# EAGLE schematic EEG_v2_0 (EAGLE 9.5.2)

## Sheet 1 of 2
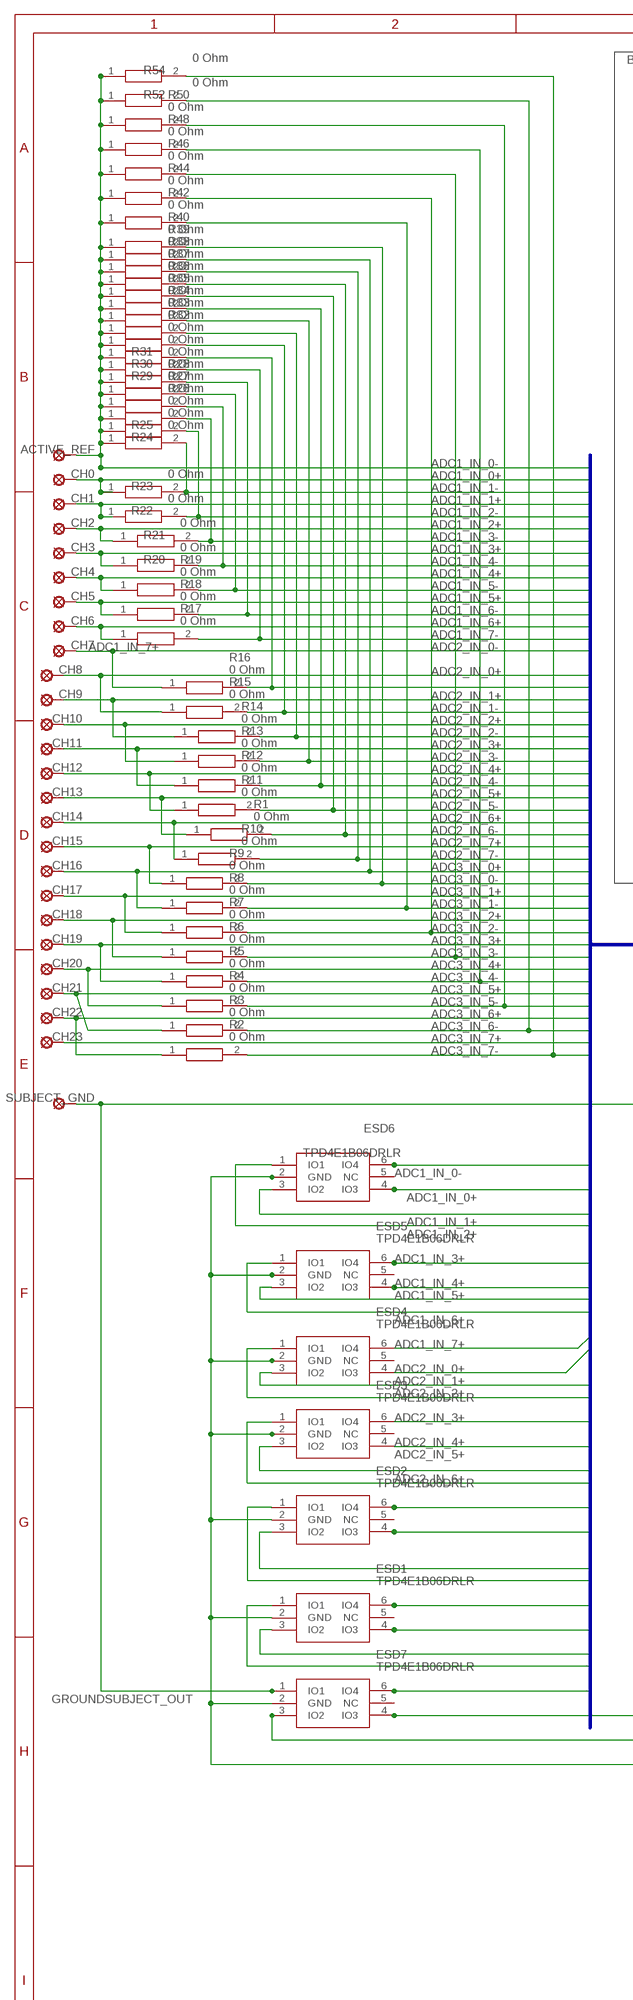
[diagram p0: schematic, sheet 1, part 1 of 2]
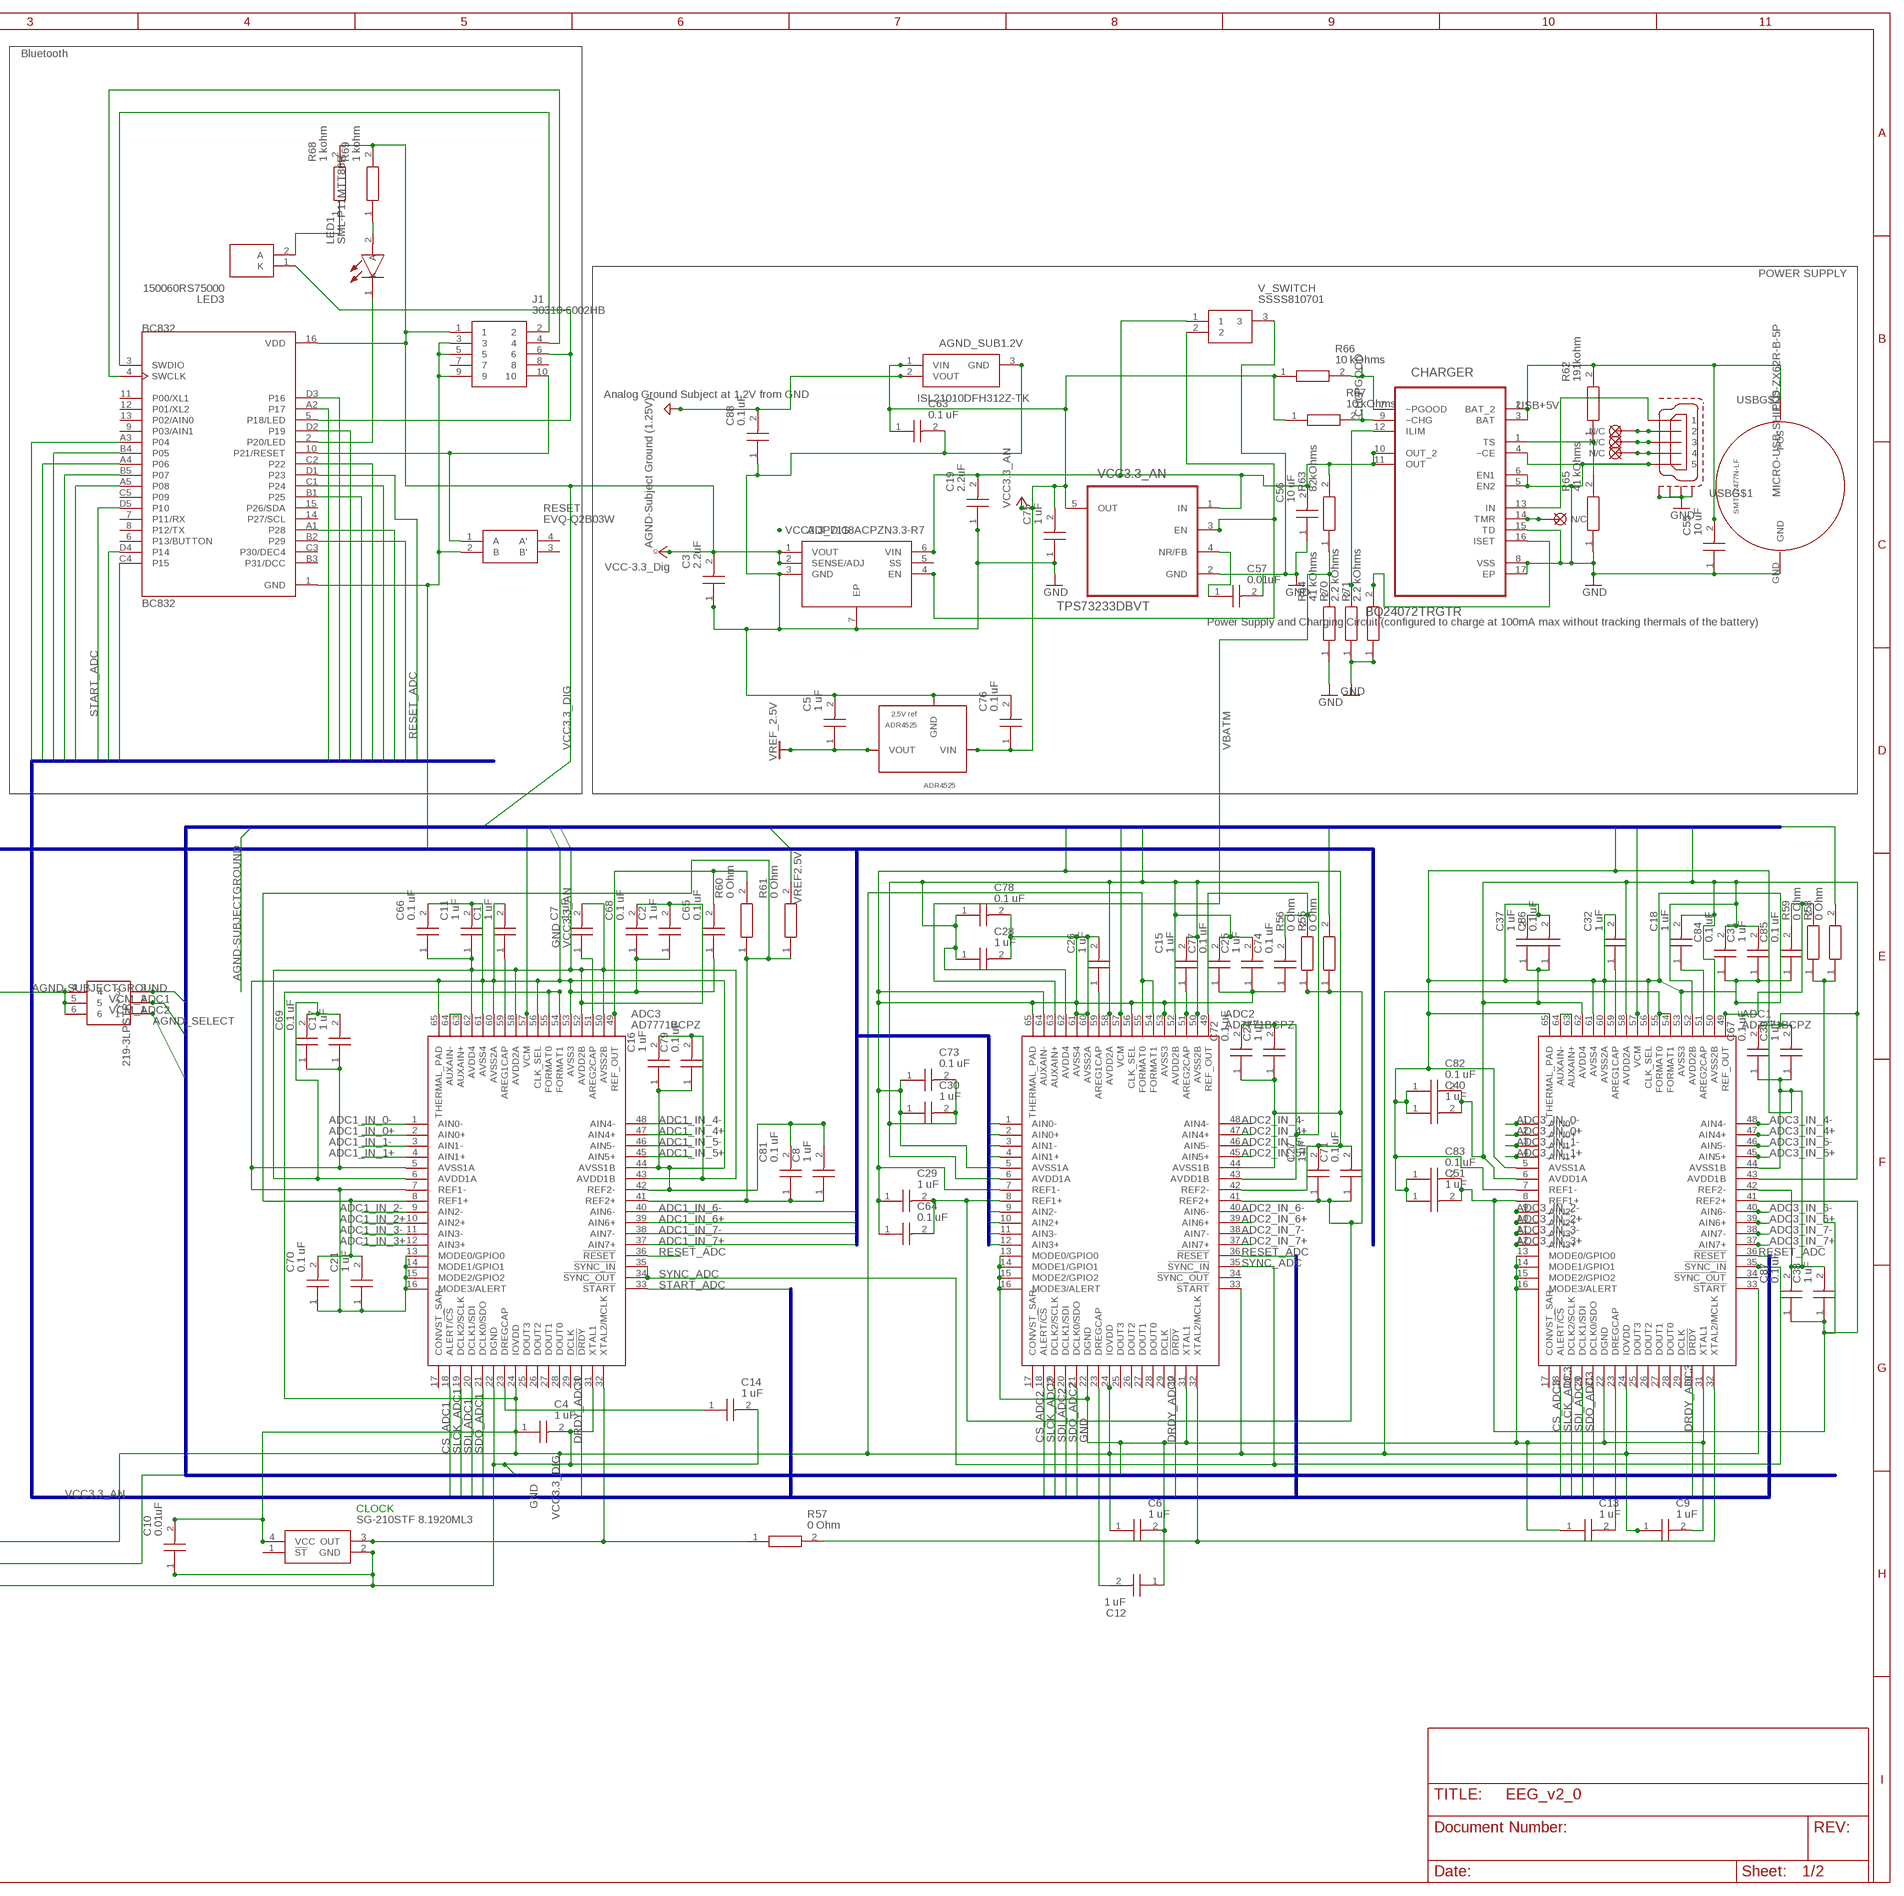
[diagram p1: schematic, sheet 1, part 2 of 2]

### Parts
ACTIVE_REF  SE11  [SE11]
ADC1  AD7771BCPZ  [QFN50P900X900X80-65N]
ADC2  AD7771BCPZ  [QFN50P900X900X80-65N]
ADC3  AD7771BCPZ  [QFN50P900X900X80-65N]
ADC_REF  SMTU2477N-LF  [SMTU2477N-LF]
ADR4525  ADR4525  [SOIC-8]
AGND_SELECT  219-3LPSTR  [2193LPSTR]
AGND_SUB1.2V  ISL21010DFH312Z-TK  [SOT95P237X112-3N]
BC832  BC832  [XCVR_BC832]
C1  1 uF  JMK105BJ105MP-F  [CAPC1005X33N]
C2  1 uF  JMK105BJ105MP-F  [CAPC1005X33N]
C3  2.2uF  GRM033R60J225ME47D  [CAPC0603X33N]
C4  1 uF  JMK105BJ105MP-F  [CAPC1005X33N]
C5  1 uF  JMK105BJ105MP-F  [CAPC1005X33N]
C6  1 uF  JMK105BJ105MP-F  [CAPC1005X33N]
C7  1 uF  JMK105BJ105MP-F  [CAPC1005X33N]
C8  1 uF  JMK105BJ105MP-F  [CAPC1005X33N]
C9  1 uF  JMK105BJ105MP-F  [CAPC1005X33N]
C10  0.01uF  GRM022R60J103ME19L  [CAPC0402X22N]
C11  1 uF  JMK105BJ105MP-F  [CAPC1005X33N]
C12  1 uF  JMK105BJ105MP-F  [CAPC1005X33N]
C13  1 uF  JMK105BJ105MP-F  [CAPC1005X33N]
C14  1 uF  JMK105BJ105MP-F  [CAPC1005X33N]
C15  1 uF  JMK105BJ105MP-F  [CAPC1005X33N]
C16  1 uF  JMK105BJ105MP-F  [CAPC1005X33N]
C17  1 uF  JMK105BJ105MP-F  [CAPC1005X33N]
C18  1 uF  JMK105BJ105MP-F  [CAPC1005X33N]
C19  2.2uF  GRM033R60J225ME47D  [CAPC0603X33N]
C21  1 uF  JMK105BJ105MP-F  [CAPC1005X33N]
C24  1 uF  JMK105BJ105MP-F  [CAPC1005X33N]
C25  1 uF  JMK105BJ105MP-F  [CAPC1005X33N]
C26  1 uF  JMK105BJ105MP-F  [CAPC1005X33N]
C27  1 uF  JMK105BJ105MP-F  [CAPC1005X33N]
C28  1 uF  JMK105BJ105MP-F  [CAPC1005X33N]
C29  1 uF  JMK105BJ105MP-F  [CAPC1005X33N]
C30  1 uF  JMK105BJ105MP-F  [CAPC1005X33N]
C31  1 uF  JMK105BJ105MP-F  [CAPC1005X33N]
C32  1 uF  JMK105BJ105MP-F  [CAPC1005X33N]
C37  1 uF  JMK105BJ105MP-F  [CAPC1005X33N]
C38  1 uF  JMK105BJ105MP-F  [CAPC1005X33N]
C39  1 uF  JMK105BJ105MP-F  [CAPC1005X33N]
C40  1 uF  JMK105BJ105MP-F  [CAPC1005X33N]
C51  1 uF  JMK105BJ105MP-F  [CAPC1005X33N]
C55  10 uF  EMK107BBJ106MA-T  [CAPC1608X100N]
C56  10 uF  EMK107BBJ106MA-T  [CAPC1608X100N]
C57  0.01uF  GRM022R60J103ME19L  [CAPC0402X22N]
C63  0.1 uF  01016D104MAT2A  [CAPC0402X22N]
C64  0.1 uF  01016D104MAT2A  [CAPC0402X22N]
C65  0.1 uF  01016D104MAT2A  [CAPC0402X22N]
C66  0.1 uF  01016D104MAT2A  [CAPC0402X22N]
C67  0.1 uF  01016D104MAT2A  [CAPC0402X22N]
C68  0.1 uF  01016D104MAT2A  [CAPC0402X22N]
C69  0.1 uF  01016D104MAT2A  [CAPC0402X22N]
C70  0.1 uF  01016D104MAT2A  [CAPC0402X22N]
C71  0.1 uF  01016D104MAT2A  [CAPC0402X22N]
C72  0.1 uF  01016D104MAT2A  [CAPC0402X22N]
C73  0.1 uF  01016D104MAT2A  [CAPC0402X22N]
C74  0.1 uF  01016D104MAT2A  [CAPC0402X22N]
C75  1 uF  01016D104MAT2A  [CAPC0402X22N]
C76  0.1 uF  01016D104MAT2A  [CAPC0402X22N]
C77  0.1 uF  01016D104MAT2A  [CAPC0402X22N]
C78  0.1 uF  01016D104MAT2A  [CAPC0402X22N]
C79  0.1 uF  01016D104MAT2A  [CAPC0402X22N]
C81  0.1 uF  01016D104MAT2A  [CAPC0402X22N]
C82  0.1 uF  01016D104MAT2A  [CAPC0402X22N]
C83  0.1 uF  01016D104MAT2A  [CAPC0402X22N]
C84  0.1 uF  01016D104MAT2A  [CAPC0402X22N]
C85  0.1 uF  01016D104MAT2A  [CAPC0402X22N]
C86  0.1 uF  01016D104MAT2A  [CAPC0402X22N]
C87  0.1 uF  01016D104MAT2A  [CAPC0402X22N]
C88  0.1 uF  01016D104MAT2A  [CAPC0402X22N]
CH0  SE11  [SE11]
CH1  SE11  [SE11]
CH2  SE11  [SE11]
CH3  SE11  [SE11]
CH4  SE11  [SE11]
CH5  SE11  [SE11]
CH6  SE11  [SE11]
CH7  SE11  [SE11]
CH8  SE11  [SE11]
CH9  SE11  [SE11]
CH10  SE11  [SE11]
CH11  SE11  [SE11]
CH12  SE11  [SE11]
CH13  SE11  [SE11]
CH14  SE11  [SE11]
CH15  SE11  [SE11]
CH16  SE11  [SE11]
CH17  SE11  [SE11]
CH18  SE11  [SE11]
CH19  SE11  [SE11]
CH20  SE11  [SE11]
CH21  SE11  [SE11]
CH22  SE11  [SE11]
CH23  SE11  [SE11]
CHARGER  BQ24072TRGTR  [QFN50P300X300X100-17N]
CLOCK  SG-210STF 8.1920ML3  SG-210STF_8.0000MY3  [SG210STF80000MY3]
ESD1  TPD4E1B06DRLR  [SOP50P160X60-6N]
ESD2  TPD4E1B06DRLR  [SOP50P160X60-6N]
ESD3  TPD4E1B06DRLR  [SOP50P160X60-6N]
ESD4  TPD4E1B06DRLR  [SOP50P160X60-6N]
ESD5  TPD4E1B06DRLR  [SOP50P160X60-6N]
ESD6  TPD4E1B06DRLR  [SOP50P160X60-6N]
ESD7  TPD4E1B06DRLR  [SOP50P160X60-6N]
J1  30310-6002HB  [SHDR10W64P254_2X5_2030X878X930]
LED1  SML-P11MTT86R  [LEDC1006X25N]
LED3  150060RS75000  [LEDC1608X80N]
R1  0 Ohm  CRCW06030000Z0EAC  [RESC1608X55N]
R2  0 Ohm  CRCW06030000Z0EAC  [RESC1608X55N]
R3  0 Ohm  CRCW06030000Z0EAC  [RESC1608X55N]
R4  0 Ohm  CRCW06030000Z0EAC  [RESC1608X55N]
R5  0 Ohm  CRCW06030000Z0EAC  [RESC1608X55N]
R6  0 Ohm  CRCW06030000Z0EAC  [RESC1608X55N]
R7  0 Ohm  CRCW06030000Z0EAC  [RESC1608X55N]
R8  0 Ohm  CRCW06030000Z0EAC  [RESC1608X55N]
R9  0 Ohm  CRCW06030000Z0EAC  [RESC1608X55N]
R10  0 Ohm  CRCW06030000Z0EAC  [RESC1608X55N]
R11  0 Ohm  CRCW06030000Z0EAC  [RESC1608X55N]
R12  0 Ohm  CRCW06030000Z0EAC  [RESC1608X55N]
R13  0 Ohm  CRCW06030000Z0EAC  [RESC1608X55N]
R14  0 Ohm  CRCW06030000Z0EAC  [RESC1608X55N]
R15  0 Ohm  CRCW06030000Z0EAC  [RESC1608X55N]
R16  0 Ohm  CRCW06030000Z0EAC  [RESC1608X55N]
R17  0 Ohm  CRCW06030000Z0EAC  [RESC1608X55N]
R18  0 Ohm  CRCW06030000Z0EAC  [RESC1608X55N]
R19  0 Ohm  CRCW06030000Z0EAC  [RESC1608X55N]
R20  0 Ohm  CRCW06030000Z0EAC  [RESC1608X55N]
R21  0 Ohm  CRCW06030000Z0EAC  [RESC1608X55N]
R22  0 Ohm  CRCW06030000Z0EAC  [RESC1608X55N]
R23  0 Ohm  CRCW06030000Z0EAC  [RESC1608X55N]
R24  0 Ohm  CRCW06030000Z0EAC  [RESC1608X55N]
R25  0 Ohm  CRCW06030000Z0EAC  [RESC1608X55N]
R26  0 Ohm  CRCW06030000Z0EAC  [RESC1608X55N]
R27  0 Ohm  CRCW06030000Z0EAC  [RESC1608X55N]
R28  0 Ohm  CRCW06030000Z0EAC  [RESC1608X55N]
R29  0 Ohm  CRCW06030000Z0EAC  [RESC1608X55N]
R30  0 Ohm  CRCW06030000Z0EAC  [RESC1608X55N]
R31  0 Ohm  CRCW06030000Z0EAC  [RESC1608X55N]
R32  0 Ohm  CRCW06030000Z0EAC  [RESC1608X55N]
R33  0 Ohm  CRCW06030000Z0EAC  [RESC1608X55N]
R34  0 Ohm  CRCW06030000Z0EAC  [RESC1608X55N]
R35  0 Ohm  CRCW06030000Z0EAC  [RESC1608X55N]
R36  0 Ohm  CRCW06030000Z0EAC  [RESC1608X55N]
R37  0 Ohm  CRCW06030000Z0EAC  [RESC1608X55N]
R38  0 Ohm  CRCW06030000Z0EAC  [RESC1608X55N]
R39  0 Ohm  CRCW06030000Z0EAC  [RESC1608X55N]
R40  0 Ohm  CRCW06030000Z0EAC  [RESC1608X55N]
R42  0 Ohm  CRCW06030000Z0EAC  [RESC1608X55N]
R44  0 Ohm  CRCW06030000Z0EAC  [RESC1608X55N]
R46  0 Ohm  CRCW06030000Z0EAC  [RESC1608X55N]
R48  0 Ohm  CRCW06030000Z0EAC  [RESC1608X55N]
R50  0 Ohm  CRCW06030000Z0EAC  [RESC1608X55N]
R52  0 Ohm  CRCW06030000Z0EAC  [RESC1608X55N]
R54  0 Ohm  CRCW06030000Z0EAC  [RESC1608X55N]
R55  0 Ohm  CRCW06030000Z0EAC  [RESC1608X55N]
R56  0 Ohm  CRCW06030000Z0EAC  [RESC1608X55N]
R57  0 Ohm  CRCW06030000Z0EAC  [RESC1608X55N]
R58  0 Ohm  CRCW06030000Z0EAC  [RESC1608X55N]
R59  0 Ohm  CRCW06030000Z0EAC  [RESC1608X55N]
R60  0 Ohm  CRCW06030000Z0EAC  [RESC1608X55N]
R61  0 Ohm  CRCW06030000Z0EAC  [RESC1608X55N]
R62  191kohm  RC0201FR-07191KL  [RESC0603X26N]
R63  82kOhms  ERA-3AEB823V  [RESC1608X55N]
R64  41 kOhms  CRCW020141K2FNED  [RESC0603X28N]
R65  41 kOhms  CRCW020141K2FNED  [RESC0603X28N]
R66  10 kOhms  RC0100JR-0710KL  [RESC0402X15N]
R67  10 kOhms  RC0100JR-0710KL  [RESC0402X15N]
R68  1 kohm  RC0201JR-073R3L  [RESC0603X26N]
R69  1 kohm  RC0201JR-073R3L  [RESC0603X26N]
R70  2.2 kOhms  CRCW12102K20FKEAHP  [RESC3225X70N]
R71  2.2 kOhms  CRCW12102K20FKEAHP  [RESC3225X70N]
RESET  EVQ-Q2B03W  [EVQQ2]
SUBJECT_GND  SE11  [SE11]
U$10  N/C  (no package)
U$11  N/C  (no package)
U$12  N/C  (no package)
U$13  N/C  (no package)
USB  MICRO-USB-SHIELD-ZX62R-B-5P  [ZX62R-B-5P]
V_SWITCH  SSSS810701  [SSSS810701]
VCC3.3_AN  TPS73233DBVT  [SOT95P280X145-5N]
VCC3.3_DIG  ADP7118ACPZN3.3-R7  [SON65P200X200X65-7N]

### Nets
-CHG: CHARGER.9(~CHG) R67.2
-PGOOD: CHARGER.7(~PGOOD) R66.2
ADC1_IN_0+: ADC3.2(AIN0+) CH0.MP ESD6.4(IO3) R23.1
ADC1_IN_0-: ACTIVE_REF.MP ADC3.1(AIN0-) ESD6.6(IO4) R24.1 R25.1 R26.1 R27.1 R28.1 R29.1 R30.1 R31.1 R32.1 R33.1 R34.1 R35.1 R36.1 R37.1 R38.1 R39.1 R40.1 R42.1 R44.1 R46.1 R48.1 R50.1 R52.1 R54.1
ADC1_IN_1+: ADC3.4(AIN1+) CH1.MP ESD6.3(IO2) R22.1
ADC1_IN_1-: ADC3.3(AIN1-) R23.2 R24.2
ADC1_IN_2+: ADC3.10(AIN2+) CH2.MP ESD6.1(IO1) R21.1
ADC1_IN_2-: ADC3.9(AIN2-) R22.2 R25.2
ADC1_IN_3+: ADC3.12(AIN3+) CH3.MP ESD5.6(IO4) R20.1
ADC1_IN_3-: ADC3.11(AIN3-) R21.2 R26.2
ADC1_IN_4+: ADC3.47(AIN4+) CH4.MP ESD5.4(IO3) R19.1
ADC1_IN_4-: ADC3.48(AIN4-) R20.2 R27.2
ADC1_IN_5+: ADC3.45(AIN5+) CH5.MP ESD5.3(IO2) R18.1
ADC1_IN_5-: ADC3.46(AIN5-) R19.2 R28.2
ADC1_IN_6+: ADC3.39(AIN6+) CH6.MP ESD5.1(IO1) R17.1
ADC1_IN_6-: ADC3.40(AIN6-) R18.2 R29.2
ADC1_IN_7+: ADC3.37(AIN7+) CH7.MP ESD4.4(IO3) R16.1
ADC1_IN_7-: ADC3.38(AIN7-) R17.2 R30.2
ADC2_IN_0+: ADC2.2(AIN0+) CH8.MP ESD4.6(IO4) R15.1
ADC2_IN_0-: ADC2.1(AIN0-) R16.2 R31.2
ADC2_IN_1+: ADC2.4(AIN1+) CH9.MP ESD4.3(IO2) R14.1
ADC2_IN_1-: ADC2.3(AIN1-) R15.2 R32.2
ADC2_IN_2+: ADC2.10(AIN2+) CH10.MP ESD4.1(IO1) R13.1
ADC2_IN_2-: ADC2.9(AIN2-) R14.2 R33.2
ADC2_IN_3+: ADC2.12(AIN3+) CH11.MP ESD3.4(IO3) R12.1
ADC2_IN_3-: ADC2.11(AIN3-) R13.2 R34.2
ADC2_IN_4+: ADC2.47(AIN4+) CH12.MP ESD3.6(IO4) R11.1
ADC2_IN_4-: ADC2.48(AIN4-) R12.2 R35.2
ADC2_IN_5+: ADC2.45(AIN5+) CH13.MP ESD3.3(IO2) R1.1
ADC2_IN_5-: ADC2.46(AIN5-) R11.2 R36.2
ADC2_IN_6+: ADC2.39(AIN6+) CH14.MP ESD3.1(IO1) R10.1
ADC2_IN_6-: ADC2.40(AIN6-) R1.2 R37.2
ADC2_IN_7+: ADC2.37(AIN7+) CH15.MP ESD2.6(IO4) R9.1
ADC2_IN_7-: ADC2.38(AIN7-) R10.2 R38.2
ADC3_IN_0+: ADC1.2(AIN0+) CH16.MP ESD2.4(IO3) R8.1 R39.2
ADC3_IN_0-: ADC1.1(AIN0-) R9.2 R40.2
ADC3_IN_1+: ADC1.4(AIN1+) CH17.MP ESD2.3(IO2) R7.1
ADC3_IN_1-: ADC1.3(AIN1-) R8.2 R42.2
ADC3_IN_2+: ADC1.10(AIN2+) CH18.MP ESD2.1(IO1) R6.1
ADC3_IN_2-: ADC1.9(AIN2-) R7.2 R44.2
ADC3_IN_3+: ADC1.12(AIN3+) CH19.MP ESD1.6(IO4) R5.1
ADC3_IN_3-: ADC1.11(AIN3-) R6.2 R46.2
ADC3_IN_4+: ADC1.47(AIN4+) CH20.MP ESD1.4(IO3) R4.1
ADC3_IN_4-: ADC1.48(AIN4-) R5.2 R48.2
ADC3_IN_5+: ADC1.45(AIN5+) CH21.MP ESD1.3(IO2) R3.1
ADC3_IN_5-: ADC1.46(AIN5-) R4.2 R50.2
ADC3_IN_6+: ADC1.39(AIN6+) CH22.MP ESD1.1(IO1) R2.1
ADC3_IN_6-: ADC1.40(AIN6-) R3.2 R52.2
ADC3_IN_7+: ADC1.37(AIN7+) CH23.MP ESD7.6(IO4)
ADC3_IN_7-: ADC1.38(AIN7-) R2.2 R54.2
AGND-SUBJECTGROUND [power]: AGND_SELECT.3 AGND_SUB1.2V.2(VOUT) C88.2 ; supply symbol labelled AGND-Subject Ground (1.25V)
CS_ADC1: ADC3.18(ALERT/!CS) BC832.A4(P06)
CS_ADC2: ADC2.18(ALERT/!CS) BC832.A5(P08)
CS_ADC3: ADC1.18(ALERT/!CS) BC832.C1(P24)
DRDY_ADC1: ADC3.30(!DRDY) BC832.A2(P17)
DRDY_ADC2: ADC2.30(!DRDY) BC832.D4(P14)
DRDY_ADC3: ADC1.30(!DRDY) BC832.B1(P25)
GND [power]: ADC1.5(AVSS1A) ADC1.7(REF1-) ADC1.13(MODE0/GPIO0) ADC1.14(MODE1/GPIO1) ADC1.15(MODE2/GPIO2) ADC1.16(MODE3/ALERT) ADC1.22(DGND) ADC1.31(XTAL1) ADC1.42(REF2-) ADC1.44(AVSS1B) ADC1.53(AVSS3) ADC1.56(CLK_SEL) ADC1.60(AVSS2A) ADC1.61(AVSS4) ADC1.65(THERMAL_PAD) ADC2.5(AVSS1A) ADC2.7(REF1-) ADC2.13(MODE0/GPIO0) ADC2.14(MODE1/GPIO1) ADC2.15(MODE2/GPIO2) ADC2.16(MODE3/ALERT) ADC2.22(DGND) ADC2.31(XTAL1) ADC2.42(REF2-) ADC2.44(AVSS1B) ADC2.53(AVSS3) ADC2.56(CLK_SEL) ADC2.60(AVSS2A) ADC2.61(AVSS4) ADC2.64(AUXAIN-) ADC2.65(THERMAL_PAD) ADC3.5(AVSS1A) ADC3.7(REF1-) ADC3.13(MODE0/GPIO0) ADC3.14(MODE1/GPIO1) ADC3.15(MODE2/GPIO2) ADC3.16(MODE3/ALERT) ADC3.22(DGND) ADC3.31(XTAL1) ADC3.42(REF2-) ADC3.44(AVSS1B) ADC3.53(AVSS3) ADC3.56(CLK_SEL) ADC3.60(AVSS2A) ADC3.61(AVSS4) ADC3.65(THERMAL_PAD) ADC_REF.GND ADR4525.4(GND) AGND_SUB1.2V.3(GND) BC832.1(GND) C1.2 C2.1 C3.1 C4.2 C5.2 C6.2 C8.2 C9.2 C10.1 C11.2 C12.1 C13.1 C14.2 C16.1 C17.1 C19.1 C21.1 C24.1 C25.1 C26.2 C27.2 C28.2 C29.1 C30.1 C31.1 C32.2 C37.2 C38.2 C39.1 C40.1 C51.1 C55.1 C56.1 C57.2 C63.2 C64.1 C65.1 C66.2 C67.1 C68.1 C69.1 C70.1 C71.2 C72.1 C73.1 C74.1 C75.1 C76.2 C77.1 C78.2 C79.1 C81.2 C82.1 C83.1 C84.1 C85.1 C86.2 C87.2 C88.1 CHARGER.4(~CE) CHARGER.5(EN2) CHARGER.6(EN1) CHARGER.8(VSS) CHARGER.15(TD) CHARGER.17(EP) CLOCK.2(GND) ESD1.2(GND) ESD2.2(GND) ESD3.2(GND) ESD4.2(GND) ESD5.2(GND) ESD6.2(GND) ESD7.2(GND) J1.3 J1.5 J1.9 R64.1 R65.1 R70.1 R71.1 RESET.2(B) USB.5 USB.M1(S1) USB.M2(S2) USB.M3(S3) USB.M4(S4) V_SWITCH.3 VCC3.3_AN.2(GND) VCC3.3_DIG.3(GND) VCC3.3_DIG.7(EP)
GROUNDSUBJECT_OUT [power]: AGND_SELECT.4 AGND_SELECT.5 AGND_SELECT.6 ESD7.1(IO1) SUBJECT_GND.MP
N$1: ADC3.59(AREG1CAP) C1.1
N$2: ADC2.23(DREGCAP) C12.2
N$3: ADC2.49(REF_OUT) C74.2 R56.2
N$4: ADC1.49(REF_OUT) C85.2 R59.2
N$5: BC832.5(P18/LED) J1.6 LED3.1(K)
N$6: BC832.2(P20/LED) LED1.1(K)
N$7: ADC3.63(AUXAIN+) ADC3.64(AUXAIN-)
N$8: ADC3.51(AREG2CAP) C7.1
N$9: V_SWITCH.2 VCC3.3_AN.3(EN) VCC3.3_DIG.4(EN)
N$10: LED3.2(A) R68.1
N$11: LED1.2(A) R69.1
N$12: BC832.3(SWDIO) J1.2
N$13: ADC2.51(AREG2CAP) C15.1
N$14: ADC3.23(DREGCAP) C14.1
N$15: BC832.4(SWCLK) J1.4
N$16: ADC1.23(DREGCAP) C13.2
N$17: BC832.10(P21/RESET) J1.10 RESET.1(A)
N$18: C19.2 C56.2 CHARGER.10(OUT_2) CHARGER.11(OUT) R63.2 V_SWITCH.1 VCC3.3_AN.1(IN) VCC3.3_DIG.6(VIN)
N$19: C57.1 VCC3.3_AN.4(NR/FB)
N$20: ADC1.63(AUXAIN+) ADC1.64(AUXAIN-)
N$21: ADC1.59(AREG1CAP) C32.1
N$22: ADC2.59(AREG1CAP) C26.1
N$26: ADC1.51(AREG2CAP) C18.1
N$31: ADC2.8(REF1+) ADC2.41(REF2+) C27.1 C29.2 C64.2 C71.1 R55.1 R56.1
N$38: ADC1.8(REF1+) ADC1.41(REF2+) C38.1 C51.2 C83.2 C87.1 R58.1 R59.1
N$39: CHARGER.1(TS) R62.1 R65.2
N$40: U$11.N/C USB.3
N$41: ADC_REF.POS C55.2 CHARGER.2(BAT_2) CHARGER.3(BAT) R62.2
N$42: U$12.N/C USB.4
N$46: U$10.N/C USB.2
N$53: CHARGER.14(TMR) U$13.N/C
N$58: CHARGER.16(ISET) R71.2
N$60: CHARGER.12(ILIM) R70.2
REF_ADC1_IN: ADC3.8(REF1+) ADC3.41(REF2+) C8.1 C21.2 C70.2 C81.1 R60.1 R61.1
REF_ADC1_OUT: ADC3.49(REF_OUT) C65.2 R60.2
RESET_ADC: ADC1.36(!RESET) ADC2.36(!RESET) ADC3.36(!RESET) BC832.D1(P23)
SDI_ADC1: ADC3.20(DCLK1/SDI) BC832.C4(P15)
SDI_ADC2: ADC2.20(DCLK1/SDI) BC832.B5(P07)
SDI_ADC3: ADC1.20(DCLK1/SDI) BC832.A1(P28)
SDO_ADC1: ADC3.21(DCLK0/SDO) BC832.D3(P16)
SDO_ADC2: ADC2.21(DCLK0/SDO) BC832.B4(P05)
SDO_ADC3: ADC1.21(DCLK0/SDO) BC832.B2(P29)
SLCK_ADC1: ADC3.19(DCLK2/SCLK) BC832.A3(P04)
SLCK_ADC2: ADC2.19(DCLK2/SCLK) BC832.D2(P19)
SLCK_ADC3: ADC1.19(DCLK2/SCLK) BC832.C2(P22)
START_ADC: ADC3.33(!START) BC832.D5(P10)
SYNC_ADC: ADC1.35(!SYNC_IN) ADC2.35(!SYNC_IN) ADC3.34(!SYNC_OUT) ADC3.35(!SYNC_IN)
USB+5V [power]: CHARGER.13(IN) USB.1
VBATM [power]: ADC2.63(AUXAIN+) R63.1 R64.2
VCC3.3_AN [power2]: ADC1.6(AVDD1A) ADC1.43(AVDD1B) ADC1.50(AVSS2B) ADC1.52(AVDD2B) ADC1.58(AVDD2A) ADC1.62(AVDD4) ADC2.6(AVDD1A) ADC2.43(AVDD1B) ADC2.50(AVSS2B) ADC2.52(AVDD2B) ADC2.58(AVDD2A) ADC2.62(AVDD4) ADC3.6(AVDD1A) ADC3.43(AVDD1B) ADC3.50(AVSS2B) ADC3.52(AVDD2B) ADC3.58(AVDD2A) ADC3.62(AVDD4) ADR4525.2(VIN) AGND_SUB1.2V.1(VIN) C2.2 C7.2 C11.1 C15.2 C16.2 C17.2 C18.2 C24.2 C25.2 C28.1 C30.2 C31.2 C37.1 C39.2 C40.2 C63.1 C66.1 C67.2 C68.2 C69.2 C72.2 C73.2 C75.2 C76.1 C77.2 C78.1 C79.2 C82.2 C84.2 C86.1 ESD7.3(IO2) R66.1 R67.1 VCC3.3_AN.5(OUT)
VCC3.3_DIG [power2]: ADC1.24(IOVDD) ADC1.33(!START) ADC1.54(FORMAT1) ADC1.55(FORMAT0) ADC2.24(IOVDD) ADC2.33(!START) ADC2.54(FORMAT1) ADC2.55(FORMAT0) ADC3.24(IOVDD) ADC3.54(FORMAT1) ADC3.55(FORMAT0) BC832.16(VDD) C3.2 C4.1 C6.1 C9.1 C10.2 CLOCK.4(VCC) ESD7.4(IO3) J1.1 R68.2 R69.2 VCC3.3_DIG.1(VOUT) VCC3.3_DIG.2(SENSE/ADJ) ; supply symbol labelled VCC-3.3_Dig
VCM_ADC1: ADC3.57(VCM) AGND_SELECT.2
VCM_ADC2: ADC2.57(VCM) AGND_SELECT.1
VCM_ADC3: ADC1.57(VCM)
VREF2.5V: ADR4525.6(VOUT) C5.1 R55.2 R58.2 R61.2 ; supply symbol labelled VREF_2.5V
XTAL_OUT: ADC3.32(XTAL2/MCLK) CLOCK.3(OUT) R57.1
XTAL_OUT_SWITCHED: ADC1.32(XTAL2/MCLK) ADC2.32(XTAL2/MCLK) R57.2
Unconnected: ADC1.17(CONVST_SAR) ADC1.25(DOUT3) ADC1.26(DOUT2) ADC1.27(DOUT1) ADC1.28(DOUT0) ADC1.29(DCLK) ADC1.34(!SYNC_OUT) ADC2.17(CONVST_SAR) ADC2.25(DOUT3) ADC2.26(DOUT2) ADC2.27(DOUT1) ADC2.28(DOUT0) ADC2.29(DCLK) ADC2.34(!SYNC_OUT) ADC3.17(CONVST_SAR) ADC3.25(DOUT3) ADC3.26(DOUT2) ADC3.27(DOUT1) ADC3.28(DOUT0) ADC3.29(DCLK) BC832.6(P13/BUTTON) BC832.7(P11/RX) BC832.8(P12/TX) BC832.9(P03/AIN1) BC832.11(P00/XL1) BC832.12(P01/XL2) BC832.13(P02/AIN0) BC832.14(P27/SCL) BC832.15(P26/SDA) BC832.B3(P31/DCC) BC832.C3(P30/DEC4) BC832.C5(P09) CLOCK.1(!ST) ESD1.5(NC) ESD2.5(NC) ESD3.5(NC) ESD4.5(NC) ESD5.5(NC) ESD6.5(NC) ESD7.5(NC) J1.7 J1.8 RESET.3(B') RESET.4(A') VCC3.3_DIG.5(SS)

### Buses
ADC1_IN_0-,ADC1_IN_0+,ADC1_IN_1-,ADC1_IN_1+,ADC1_IN_2-,ADC1_IN_2+,ADC1_IN_3-,ADC1_IN_3+,ADC1_IN_4-,ADC1_IN_4+,ADC1_IN_5-,ADC1_IN_5+,ADC1_IN_6-,ADC1_IN_6+,ADC1_IN_7-,ADC1_IN_7+,ADC2_IN_0+,ADC2_IN_0-,ADC2_IN_1+,ADC2_IN_1-,ADC2_IN_2+,ADC2_IN_2-,ADC2_IN_3+,ADC2_IN_3-,ADC2_IN_4+,ADC2_IN_4-,ADC2_IN_5+,ADC2_IN_5-,ADC2_IN_6+,ADC2_IN_6-,ADC2_IN_7+,ADC2_IN_7-,ADC3_IN_0-,ADC3_IN_0+,ADC3_IN_1-,ADC3_IN_1+,ADC3_IN_2-,ADC3_IN_2+,ADC3_IN_3+,ADC3_IN_3-,ADC3_IN_4-,ADC3_IN_4+,ADC3_IN_5-,ADC3_IN_5+,ADC3_IN_6-,ADC3_IN_6+,ADC3_IN_7-,ADC3_IN_7+,GND,N$52,VCC3.3_AN,VREF2.5V
POWER:AGND-SUBJECTGROUND,GND,VCC3.3_AN,VCC3.3_DIG,VCM_ADC1,VCM_ADC2,VCM_ADC3,VREF2.5V
CS_ADC1,CS_ADC2,CS_ADC3,DRDY_ADC1,DRDY_ADC2,DRDY_ADC3,RESET_ADC,SDI_ADC1,SDI_ADC2,SDI_ADC3,SDO_ADC1,SDO_ADC2,SDO_ADC3,SLCK_ADC1,SLCK_ADC2,SLCK_ADC3,START_ADC

### Notes on the sheet
- Bluetooth
- POWER SUPPLY
- Analog Ground Subject at 1.2V from GND
- Power Supply and Charging Circuit (configured to charge at 100mA max without tracking thermals of the battery)

## Sheet 2 of 2

## Library data of the parts
ACTIVE_REF CH0 CH1-CH23 SUBJECT_GND = solpad:SE11: SOLDER PAD RTM, drill 1,1mm, distributor Buerklin, 07F810
ADC1-ADC3 = AD7771BCPZ:AD7771BCPZ: Analog to Digital Converters - ADC Eight 24B 128ksps SD-ADC PGA SRC Source: Datasheet <http://www.analog.com/media/en/technical-documentation/data-sheets/AD7771.pdf>; DESCRIPTION: Analog to Digital Converters - ADC Eight 24B 128ksps SD-ADC PGA SRC; HEIGHT: 0.8mm; MANUFACTURER_NAME: Analog Devices; MANUFACTURER_PART_NUMBER: AD7771BCPZ; MOUSER_PART_NUMBER: 584-AD7771BCPZ; MOUSER_PRICE-STOCK: https://www.mouser.com/Search/Refine.aspx?Keyword=584-AD7771BCPZ
ADC_REF = traumschreiber_custom_parts:SMTU2477N-LF: SMTU2430-LF Coin Cell Battery Holders SFC MNT FOR CR2430 490PCS/REEL Mouser Part #: 614-SMTU2430-LF.TR Manufacturer Part #: SMTU2430-LF.TR Manufacturer: Renata
ADR4525 = ADR4525:ADR4525; DESCRIPTION: Series Voltage Reference IC ±0.04% 8-SOIC; DIGI-KEY_PART_NUMBER: ADR4525ARZ-R7CT-ND; DIGI-KEY_PURCHASE_URL: https://www.digikey.de/product-detail/en/analog-devices-inc/ADR4525ARZ-R7/ADR4525ARZ-R7CT-ND/4909196?utm_source=snapeda&utm_medium=aggregator&utm_campaign=symbol; MF: Analog Devices; MP: ADR4525; PACKAGE: SOIC-8 Analog Devices
AGND_SELECT = SamacSys_Parts:219-3LPSTR: 3 Way Surface Mount DIP Switch Single Pole Single Throw (SPST) Source: Datasheet <https://www.ctscorp.com/wp-content/uploads/219.pdf>; DESCRIPTION: 3 Way Surface Mount DIP Switch Single Pole Single Throw (SPST); HEIGHT: 3.95mm; MANUFACTURER_NAME: CTS; MANUFACTURER_PART_NUMBER: 219-3LPSTR; MOUSER_PART_NUMBER: 774-2193LPSTR; MOUSER_PRICE-STOCK: https://www.mouser.com/Search/Refine.aspx?Keyword=774-2193LPSTR; RS_PART_NUMBER: 1774327; RS_PRICE-STOCK: http://uk.rs-online.com/web/p/products/1774327
AGND_SUB1.2V = SamacSys_Parts:ISL21010DFH312Z-TK: Voltage References Micropower Voltage Reference Source: Datasheet <https://www.renesas.com/en-us/www/doc/datasheet/isl21010.pdf>; DESCRIPTION: Voltage References Micropower Voltage Reference; HEIGHT: 1.12mm; MANUFACTURER_NAME: Renesas Electronics; MANUFACTURER_PART_NUMBER: ISL21010DFH312Z-TK; MOUSER_PART_NUMBER: 968-ISL21010DFH312ZT; MOUSER_PRICE-STOCK: https://www.mouser.com/Search/ProductDetail.aspx?qs=9fLuogzTs8LVsLxgRfQnrw%3d%3d
BC832 = BC832:BC832: Micro BLE 5 Module: Nordic nRF52832 SoC with chip antenna and castellated pins; AVAILABILITY: Unavailable; DESCRIPTION: Bluetooth Bluetooth v5.0 Transceiver Module 2.4GHz Integrated, Chip Surface Mount; MF: Fanstel Corp.; MP: BC832; PACKAGE: Module Fanstel Corp.; PRICE: None
C1 C2 C4-C9 C11-C18 C21 C24-C32 C37-C40 C51 = JMK105BJ105MP-F:JMK105BJ105MP-F: Taiyo Yuden JMK105BJ105MP-F 1F MLCC 6.3V dc +/-20% Tolerance SMD Source: Datasheet <https://componentsearchengine.com/Datasheets/1/JMK105BJ105MP-F.pdf>; DESCRIPTION: Taiyo Yuden JMK105BJ105MP-F 1F MLCC 6.3V dc +/-20% Tolerance SMD; HEIGHT: 0.33mm; MANUFACTURER_NAME: TAIYO YUDEN; MANUFACTURER_PART_NUMBER: JMK105BJ105MP-F; MOUSER_PART_NUMBER: 963-JMK105BJ105MP-F; MOUSER_PRICE-STOCK: https://www.mouser.com/Search/Refine.aspx?Keyword=963-JMK105BJ105MP-F; RS_PART_NUMBER: 1843471; RS_PRICE-STOCK: https://uk.rs-online.com/web/p/products/1843471
C3 C19 = SamacSys_Parts:GRM033R60J225ME47D: Multilayer Ceramic Capacitors MLCC - SMD/SMT 0201 2.2uF 6.3volts Source: Datasheet <https://componentsearchengine.com/Datasheets/1/GRM033R60J225ME47D.pdf>; DESCRIPTION: Multilayer Ceramic Capacitors MLCC - SMD/SMT 0201 2.2uF 6.3volts; HEIGHT: 0.33mm; MANUFACTURER_NAME: Murata Electronics; MANUFACTURER_PART_NUMBER: GRM033R60J225ME47D; MOUSER_PART_NUMBER: 81-GRM033R60J225ME7D; MOUSER_PRICE-STOCK: https://www.mouser.com/Search/Refine.aspx?Keyword=81-GRM033R60J225ME7D
C10 C57 = GRM022R60J103ME19L:GRM022R60J103ME19L: Capacitor GRM02 L=0.4mm W=0.2mm T=0.2mm Source: Datasheet <https://psearch.en.murata.com/capacitor/product/GRM022R60J103ME19#.html>; DESCRIPTION: Capacitor GRM02 L=0.4mm W=0.2mm T=0.2mm; HEIGHT: 0.22mm; MANUFACTURER_NAME: Murata Electronics; MANUFACTURER_PART_NUMBER: GRM022R60J103ME19L; MOUSER_PART_NUMBER: 81-GRM022R60J103ME9L; MOUSER_PRICE-STOCK: https://www.mouser.com/Search/Refine.aspx?Keyword=81-GRM022R60J103ME9L
C55 C56 = EMK107BBJ106MA-T:EMK107BBJ106MA-T: TAIYO YUDEN - EMK107BBJ106MA-T - CAPACITOR, MLCC, X5R, 10UF, 16V, 0603, REEL Source: Datasheet <https://altium.componentsearchengine.com/Datasheets/2/EMK107BBJ106MA-T.pdf>; DESCRIPTION: TAIYO YUDEN - EMK107BBJ106MA-T - CAPACITOR, MLCC, X5R, 10UF, 16V, 0603, REEL; HEIGHT: 1mm; MANUFACTURER_NAME: TAIYO YUDEN; MANUFACTURER_PART_NUMBER: EMK107BBJ106MA-T; MOUSER_PART_NUMBER: 963-EMK107BBJ106MA-T; MOUSER_PRICE-STOCK: https://www.mouser.com/Search/Refine.aspx?Keyword=963-EMK107BBJ106MA-T; RS_PART_NUMBER: 1843904P; RS_PRICE-STOCK: http://uk.rs-online.com/web/p/products/1843904P
C63-C79 C81-C88 = 01016D104MAT2A:01016D104MAT2A: Multilayer Ceramic Capacitors MLCC - SMD/SMT 6.3V 0.1uF 20% 101 Source: Datasheet <https://componentsearchengine.com/Datasheets/1/01016D104MAT2A.pdf>; DESCRIPTION: Multilayer Ceramic Capacitors MLCC - SMD/SMT 6.3V 0.1uF 20% 101; HEIGHT: 0.22mm; MANUFACTURER_NAME: AVX; MANUFACTURER_PART_NUMBER: 01016D104MAT2A; MOUSER_PART_NUMBER: 581-01016D104MAT2A; MOUSER_PRICE-STOCK: https://www.mouser.com/Search/Refine.aspx?Keyword=581-01016D104MAT2A
CHARGER = ti:BQ24072TRGTR: 1.5A USB-Friendly Li-Ion Battery Charger and Power-Path Management IC; MPN: BQ24072TRGTR; OC_FARNELL: -; OC_NEWARK: 74R6078; PACKAGE: QFN-16; SUPPLIER: Texas Instruments
CLOCK = SamacSys_Parts:SG-210STF_8.0000MY3: Standard Clock Oscillators 8MHz 50ppm -40C +105C Source: Datasheet <https://componentsearchengine.com/Datasheets/1/SG-210STF 8.0000MY3.pdf>; DESCRIPTION: Standard Clock Oscillators 8MHz 50ppm -40C +105C; HEIGHT: 0.9mm; MANUFACTURER_NAME: Epson Timing; MANUFACTURER_PART_NUMBER: SG-210STF 8.0000MY3; MOUSER_PART_NUMBER: 732-SG210STF8.0Y3; MOUSER_PRICE-STOCK: https://www.mouser.com/Search/Refine.aspx?Keyword=732-SG210STF8.0Y3
ESD1 ESD2 = TPD4E1B06DRLR:TPD4E1B06DRLR: Bidirectional Quad-Channel High-Speed ESD Protection Device Source: Datasheet <http://www.ti.com/lit/ds/symlink/tpd4e1b06.pdf>; DESCRIPTION: Bidirectional Quad-Channel High-Speed ESD Protection Device; HEIGHT: 0.6mm; MANUFACTURER_NAME: Texas Instruments; MANUFACTURER_PART_NUMBER: TPD4E1B06DRLR; MOUSER_PART_NUMBER: 595-TPD4E1B06DRLR; MOUSER_PRICE-STOCK: https://www.mouser.com/Search/Refine.aspx?Keyword=595-TPD4E1B06DRLR
ESD3-ESD7 = SamacSys_Parts:TPD4E1B06DRLR: Bidirectional Quad-Channel High-Speed ESD Protection Device Source: Datasheet <http://www.ti.com/lit/ds/symlink/tpd4e1b06.pdf>; DESCRIPTION: Bidirectional Quad-Channel High-Speed ESD Protection Device; HEIGHT: 0.6mm; MANUFACTURER_NAME: Texas Instruments; MANUFACTURER_PART_NUMBER: TPD4E1B06DRLR; MOUSER_PART_NUMBER: 595-TPD4E1B06DRLR; MOUSER_PRICE-STOCK: https://www.mouser.com/Search/Refine.aspx?Keyword=595-TPD4E1B06DRLR
J1 = SamacSys_Parts:30310-6002HB: Headers & Wire Housings 10P STRT 4WALL GLDFL Source: Datasheet <http://multimedia.3m.com/mws/media/22504O/3mtm-100-in-loprof-hdr-100x-100strt-ra-4-wall-ts0818.pdf>; ALLIED_NUMBER: 71084740; ALLIED_PRICE-STOCK: https://www.alliedelec.com/3m-30310-6002hb/71084740/; DESCRIPTION: Headers & Wire Housings 10P STRT 4WALL GLDFL; HEIGHT: 9.3mm; MANUFACTURER_NAME: 3M; MANUFACTURER_PART_NUMBER: 30310-6002HB; MOUSER_PART_NUMBER: 517-30310-6002; MOUSER_PRICE-STOCK: https://www.mouser.com/Search/Refine.aspx?Keyword=517-30310-6002; RS_PART_NUMBER: 2508576690; RS_PRICE-STOCK: http://uk.rs-online.com/web/p/products/2508576690
LED1 = SamacSys_Parts:SML-P11MTT86R: ROHM - SML-P11MTT86R - LED, YELLOW GREEN, 2.1MCD, 569NM, 0402 Source: Datasheet <https://componentsearchengine.com/Datasheets/1/SML-P11MTT86R.pdf>; DESCRIPTION: ROHM - SML-P11MTT86R - LED, YELLOW GREEN, 2.1MCD, 569NM, 0402; HEIGHT: 0.25mm; MANUFACTURER_NAME: ROHM Semiconductor; MANUFACTURER_PART_NUMBER: SML-P11MTT86R; MOUSER_PART_NUMBER: 755-SML-P11MTT86R; MOUSER_PRICE-STOCK: https://www.mouser.com/Search/Refine.aspx?Keyword=755-SML-P11MTT86R
LED3 = SamacSys_Parts:150060RS75000: WURTH ELEKTRONIK - 150060RS75000 - LED, 0603, RED, 250MCD, 625NM Source: Datasheet <http://katalog.we-online.de/led/datasheet/150060RS75000.pdf>; DESCRIPTION: WURTH ELEKTRONIK - 150060RS75000 - LED, 0603, RED, 250MCD, 625NM; HEIGHT: 0.8mm; MANUFACTURER_NAME: Wurth Elektronik; MANUFACTURER_PART_NUMBER: 150060RS75000; MOUSER_PART_NUMBER: 710-150060RS75000; MOUSER_PRICE-STOCK: https://www.mouser.com/Search/Refine.aspx?Keyword=710-150060RS75000; RS_PART_NUMBER: 8154203P; RS_PRICE-STOCK: http://uk.rs-online.com/web/p/products/8154203P
R1-R40 R42 R44 R46 R48 R50 R52 R54-R61 = CRCW06030000Z0EAC:CRCW06030000Z0EAC: Thick Film Resistors - SMD Source: Datasheet <https://www.vishay.com/docs/28773/crcwce3.pdf>; DESCRIPTION: Thick Film Resistors - SMD; HEIGHT: 0.55mm; MANUFACTURER_NAME: Vishay; MANUFACTURER_PART_NUMBER: CRCW06030000Z0EAC; MOUSER_PART_NUMBER: 71-CRCW06030000Z0EAC; MOUSER_PRICE-STOCK: https://www.mouser.com/Search/Refine.aspx?Keyword=71-CRCW06030000Z0EAC
R62 = RC0201FR-07191KL:RC0201FR-07191KL: Thick Film Resistors - SMD Source: Datasheet <http://www.yageo.com/documents/recent/PYu-RC0201_51_RoHS_L_8.pdf>; DESCRIPTION: Thick Film Resistors - SMD; HEIGHT: 0.26mm; MANUFACTURER_NAME: YAGEO (PHYCOMP); MANUFACTURER_PART_NUMBER: RC0201FR-07191KL; MOUSER_PART_NUMBER: 603-RC0201FR-07191KL; MOUSER_PRICE-STOCK: https://www.mouser.com/Search/Refine.aspx?Keyword=603-RC0201FR-07191KL
R63 = ERA-3AEB823V:ERA-3AEB823V: RESISTOR, 0603 82 kOhm +/-0.1% 0.1 W Source: Datasheet <https://industrial.panasonic.com/cdbs/www-data/pdf/RDM0000/AOA0000C307.pdf>; DESCRIPTION: RESISTOR, 0603 82 kOhm +/-0.1% 0.1 W; HEIGHT: 0.55mm; MANUFACTURER_NAME: Panasonic; MANUFACTURER_PART_NUMBER: ERA-3AEB823V; MOUSER_PART_NUMBER: 667-ERA-3AEB823V; MOUSER_PRICE-STOCK: https://www.mouser.com/Search/Refine.aspx?Keyword=667-ERA-3AEB823V
R64 R65 = CRCW020141K2FNED:CRCW020141K2FNED: Thick Film Resistors - SMD 41.2K OHM 1% Source: Datasheet <http://www.vishay.com/docs/20035/dcrcwe3.pdf>; DESCRIPTION: Thick Film Resistors - SMD 41.2K OHM 1%; HEIGHT: 0.28mm; MANUFACTURER_NAME: Vishay; MANUFACTURER_PART_NUMBER: CRCW020141K2FNED; MOUSER_PART_NUMBER: 71-CRCW020141K2FNED; MOUSER_PRICE-STOCK: https://www.mouser.com/Search/Refine.aspx?Keyword=71-CRCW020141K2FNED
R66 R67 = RC0100JR-0710KL:RC0100JR-0710KL: Thick Film Resistors - SMD 10K OHM 5% Source: Datasheet <https://componentsearchengine.com/Datasheets/1/RC0100JR-0710KL.pdf>; DESCRIPTION: Thick Film Resistors - SMD 10K OHM 5%; HEIGHT: 0.15mm; MANUFACTURER_NAME: YAGEO (PHYCOMP); MANUFACTURER_PART_NUMBER: RC0100JR-0710KL; MOUSER_PART_NUMBER: 603-RC0100JR-0710KL; MOUSER_PRICE-STOCK: https://www.mouser.com/Search/Refine.aspx?Keyword=603-RC0100JR-0710KL
R68 R69 = RC0201JR-073R3L:RC0201JR-073R3L: YAGEO RC0201 J Source: Datasheet <http://www.yageo.com/documents/recent/PYu-RC0201_51_RoHS_L_8.pdf>; DESCRIPTION: YAGEO RC0201 J; HEIGHT: 0.26mm; MANUFACTURER_NAME: YAGEO (PHYCOMP); MANUFACTURER_PART_NUMBER: RC0201JR-073R3L; MOUSER_PART_NUMBER: 603-RC0201JR-073R3L; MOUSER_PRICE-STOCK: https://www.mouser.com/Search/Refine.aspx?Keyword=603-RC0201JR-073R3L
R70 R71 = CRCW12102K20FKEAHP:CRCW12102K20FKEAHP: Thick Film Resistors - SMD 3/4watt 2.2Kohms 1% High Power AEC-Q200 Source: Datasheet <http://componentsearchengine.com/Datasheets/1/CRCW12102K20FKEAHP.pdf>; DESCRIPTION: Thick Film Resistors - SMD 3/4watt 2.2Kohms 1% High Power AEC-Q200; HEIGHT: 0.7mm; MANUFACTURER_NAME: Vishay; MANUFACTURER_PART_NUMBER: CRCW12102K20FKEAHP; MOUSER_PART_NUMBER: 71-CRCW12102K20FKEAH; MOUSER_PRICE-STOCK: https://www.mouser.com/Search/Refine.aspx?Keyword=71-CRCW12102K20FKEAH
RESET = SamacSys_Parts:EVQ-Q2B03W: PANASONIC ELECTRONIC COMPONENTS - EVQ-Q2B03W - SWITCH, TACTILE, SPST-NO, 20mA, 15VDC, SMD Source: Datasheet <https://industrial.panasonic.com/cdbs/www-data/pdf/ATK0000/ATK0000C360.pdf>; ALLIED_NUMBER: 70270748; ALLIED_PRICE-STOCK: https://www.alliedelec.com/panasonic-evq-q2b03w/70270748/; DESCRIPTION: PANASONIC ELECTRONIC COMPONENTS - EVQ-Q2B03W - SWITCH, TACTILE, SPST-NO, 20mA, 15VDC, SMD; HEIGHT: mm; MANUFACTURER_NAME: Panasonic; MANUFACTURER_PART_NUMBER: EVQ-Q2B03W; MOUSER_PART_NUMBER: 667-EVQ-Q2B03W; MOUSER_PRICE-STOCK: https://www.mouser.com/Search/Refine.aspx?Keyword=667-EVQ-Q2B03W
U$10-U$13 = traumschreiber_custom_parts:N/C
USB = con-hirose:MICRO-USB-SHIELD-: Hirose Micro USB Connector ZX62R-B-5P: Micro B, reverse (top mount) shell SMT Supplier: DigiKey H11574CT-ND Source: http://www.hirose.co.jp/cataloge_hp/e24200011.pdf
V_SWITCH = SamacSys_Parts:SSSS810701: Slide Switches Horiz 1 Pole 2 Pos 1.1 Knob 1.5 Travel Source: Datasheet <http://www.alps.com/prod/info/E/HTML/Switch/Slide/SSSS8/SSSS810701.html>; DESCRIPTION: Slide Switches Horiz 1 Pole 2 Pos 1.1 Knob 1.5 Travel; HEIGHT: mm; MANUFACTURER_NAME: ALPS; MANUFACTURER_PART_NUMBER: SSSS810701; MOUSER_PART_NUMBER: 688-SSSS810701; MOUSER_PRICE-STOCK: https://www.mouser.com/Search/Refine.aspx?Keyword=688-SSSS810701; RS_PART_NUMBER: 1238937; RS_PRICE-STOCK: http://uk.rs-online.com/web/p/products/1238937
VCC3.3_AN = traumschreiber_custom_parts:TPS73233DBVT: Cap-Free, NMOS, 250mA Low Dropout Regulator with Reverse Current Protection; MPN: TPS73233DBVT; OC_FARNELL: -; OC_NEWARK: 87H2968; PACKAGE: SOT-23-5; SUPPLIER: Texas Instruments
VCC3.3_DIG = SamacSys_Parts:ADP7118ACPZN3.3-R7: LDO Voltage Regulators 20V 200mA LDO 3.3Vo Source: Datasheet <https://www.analog.com/media/en/technical-documentation/data-sheets/adp7118.pdf>; DESCRIPTION: LDO Voltage Regulators 20V 200mA LDO 3.3Vo; HEIGHT: 0.65mm; MANUFACTURER_NAME: Linear Technology; MANUFACTURER_PART_NUMBER: ADP7118ACPZN3.3-R7; MOUSER_PART_NUMBER: 584-P7118ACPZN3.3R7; MOUSER_PRICE-STOCK: https://www.mouser.com/Search/Refine.aspx?Keyword=584-P7118ACPZN3.3R7

## Net classes
0 default: width 0.152 mm, drill 0.381 mm
1 power: width 0.305 mm, drill 0.381 mm
2 power2: width 0.305 mm, drill 0.381 mm